# EAGLE design Pir-RElay (EAGLE 9.4.2)
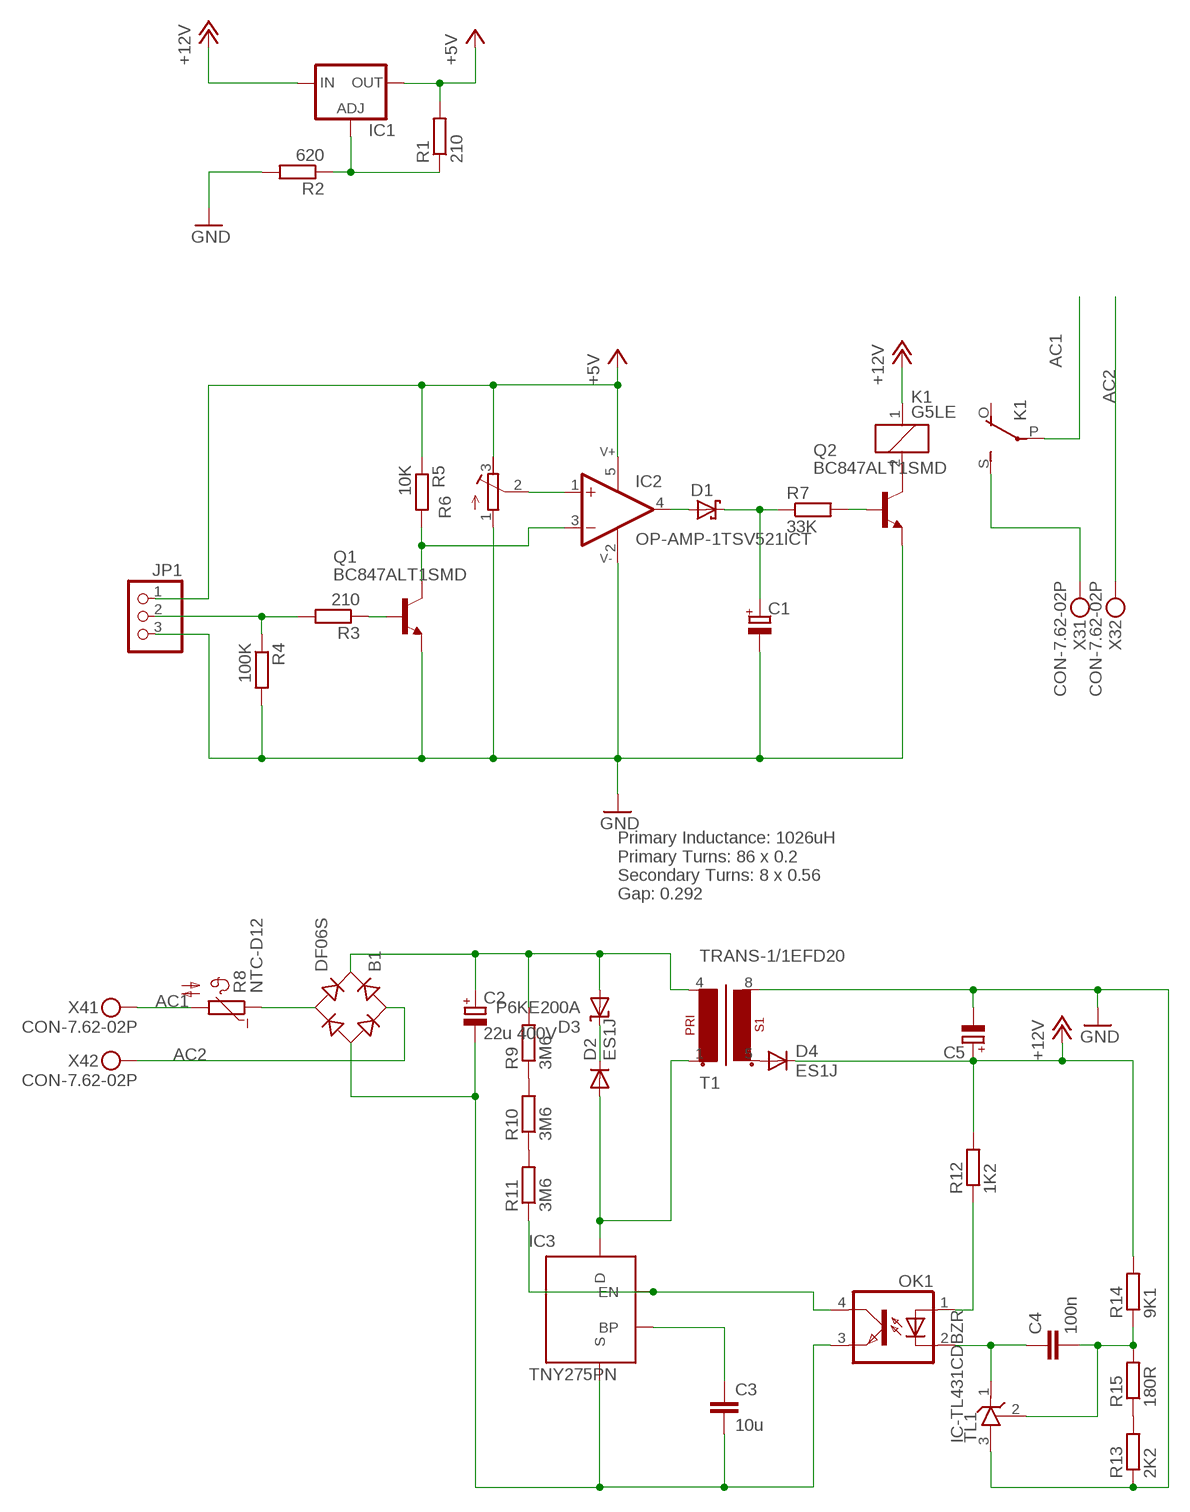
[diagram p0: schematic, sheet 1]

## Parts
B1  DF06S  [DFS]
C1  CAP-POL_E2.5-7  [E2,5-7]
C2  22u 400V  CPOL-EUE5-13  [E5-13]
C3  10u  CAP_1210  [C1210]
C4  100n  CAP_0805  [C0805]
C5  CPOL-EUE7.5-18  [E7,5-18]
D1  DIODE-SH_SOD523  [SODFL1608X65]
D2  ES1J  DIODE_ES1J  [DO214AC]
D3  P6KE200A  SUPRESSORDO-204AC  [DO15-12]
D4  ES1J  DIODE_ES1J  [DO214AC]
IC1  VREG-ADJLD1117S  [SOT230P700X180-4]
IC2  OP-AMP-1TSV521ICT  [SC70-5L]
IC3  TNY275PN  POWER-TNY275  [DIP-8C]
JP1  PINHD-1X3/90  [1X03/90]
K1  G5LE  [G5LE]
OK1  OPTOTRANSPC817  [DIL04]
Q1  BC847ALT1SMD  [SOT23]
Q2  BC847ALT1SMD  [SOT23]
R1  210  R_R0805  [RESC2012X50]
R2  620  R_R0805  [RESC2012X50]
R3  210  R_R0805  [RESC2012X50]
R4  100K  R_R0805  [RESC2012X50]
R5  10K  R_R0805  [RESC2012X50]
R6  R_POT3296X  [POT-3296X]
R7  33K  R_R0805  [RESC2012X50]
R8  NTC-D12  [NTC-D12]
R9  3M6  R_0805  [R0805]
R10  3M6  R_0805  [R0805]
R11  3M6  R_0805  [R0805]
R12  1K2  R_1206  [R1206]
R13  2K2  R_R0805  [RESC2012X50]
R14  9K1  R_1206  [R1206]
R15  180R  R_1206  [R1206]
T1  TRANS-1/1EFD20  [EFD20_8PIN]
TL1  IC-TL431CDBZR  [SOT23]
X3  CON-7.62-02P  [KF25C-7.62-02P-13]
X4  CON-7.62-02P  [KF25C-7.62-02P-13]

## Nets
+5V: IC1.2(OUT) IC1.4(OUT) IC2.5(V+) JP1.1 R1.2 R5.1 R6.3(E)
+12V: C5.+ D4.C IC1.3(IN) K1.1 R12.2 R14.2
AC1: K1.P(2:P) R8.2 X4.P$1
AC2: B1.AC1 X3.P$2 X4.P$2
GND: C1.- C5.- IC2.2(V-) JP1.3 Q1.2(E) Q2.2(E) R2.2 R4.2 R6.1(A) R13.1 T1.8(S1-2) TL1.3(A)
N$1: IC1.1(ADJ) R1.1 R2.1
N$2: B1.AC2 R8.1
N$3: K1.S(2:S) X3.P$1
N$4: Q2.1(B) R7.2
N$5: JP1.2 R3.2 R4.1
N$6: Q1.1(B) R3.1
N$7: IC2.3(-IN) Q1.3(C) R5.2
N$8: IC2.1(+IN) R6.2(S)
N$9: D1.2(A) IC2.4(OUT)
N$10: C1.+ D1.1(C) R7.1
N$11: K1.2 Q2.3(C)
N$16: B1.+ C2.+ D3.A R9.2 T1.4(P1-2)
N$17: B1.- C2.- C3.2 IC3.5(S) IC3.6(S) IC3.7(S) IC3.8(S) OK1.3(EMIT)
N$18: C3.1 IC3.2(BP)
N$19: D2.A IC3.4(D) T1.1(P1-1)
N$20: D2.C D3.C
N$21: IC3.1(EN) OK1.4(COL) R11.1
N$22: R9.1 R10.2
N$23: R10.1 R11.2
N$24: D4.A T1.5(S1-1)
N$26: OK1.1(A) R12.1
N$27: C4.1 OK1.2(C) TL1.1(C)
N$28: C4.2 R14.1 R15.2 TL1.2(R)
N$30: R13.2 R15.1
Unconnected: K1.O(2:O)

## Notes on the sheet
- Primary Inductance: 1026uH
  Primary Turns: 86 x 0.2
  Secondary Turns: 8 x 0.56
  Gap: 0.292

## Library data of the parts
B1 = rectifier:DF*S: Surface Mount Glass Passivated Bridge Rectifiers Source: Source: Comchip Bridge Rectifiers DF005S-G thru DF10S-G.pdf
C1 = Flamberm:CAP-POL_
C2 C5 = rcl:CPOL-EU: POLARIZED CAPACITOR, European symbol; SPICEPREFIX: C
C3 C4 = Namenlos:CAP_
D1 = Flamberm:DIODE-SH_
D2 D4 = Namenlos:DIODE_
D3 = Namenlos:SUPRESSOR
IC1 = Flamberm:VREG-ADJ: VOLTAGE REGULATOR
IC2 = Flamberm:OP-AMP-1
IC3 = Flamberm:POWER-TNY275
JP1 = pinhead:PINHD-1X3: PIN HEADER
K1 = relay:G5LE: RELAY 1 x switch, 10 A/120 V AC, 8 A/30 V DC, Omron; OC_FARNELL: unknown; OC_NEWARK: unknown
OK1 = Namenlos:OPTOTRANS: SHARP OPTO COUPLER; MPN: PC817X4J000F; OC_FARNELL: 9707727; OC_NEWARK: 97K7059
Q1 Q2 = transistor-npn:BC847*: NPN Transistor
R1-R5 R7 R13 = Flamberm:R_
R6 = Flamberm:R_POT
R8 = Namenlos:NTC-D12
R9-R12 R14 R15 = Namenlos:R_
T1 = Namenlos:TRANS-1/1
TL1 = Namenlos:IC-TL431
X3 X4 = Flamberm:CON-7.62-02P

## Board
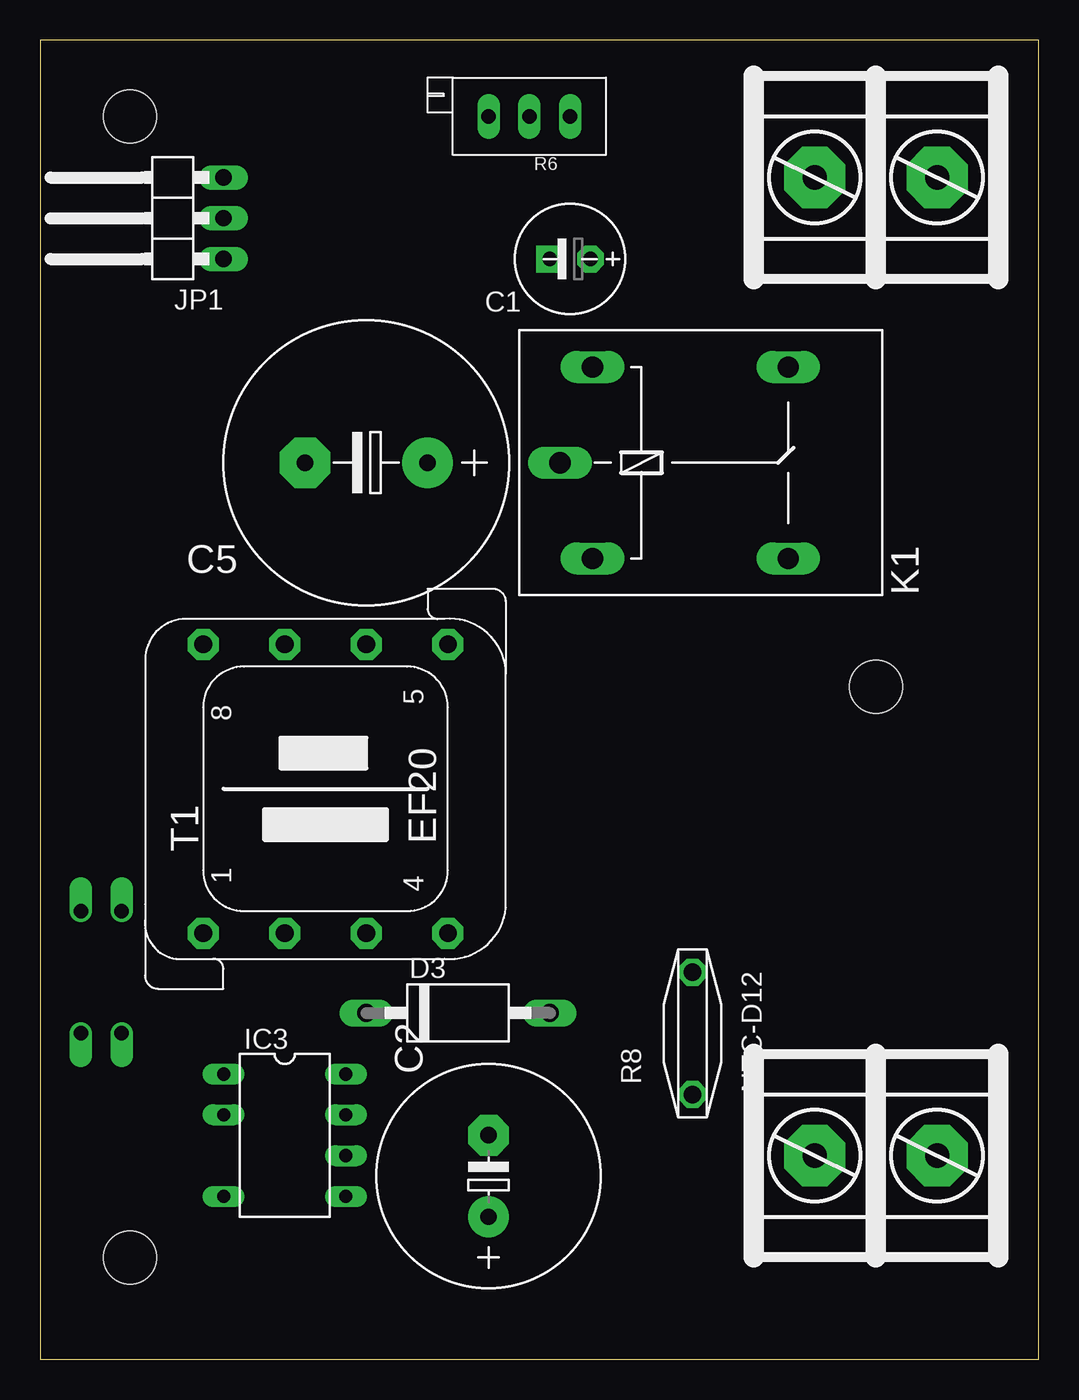
[diagram p1: board, top side]
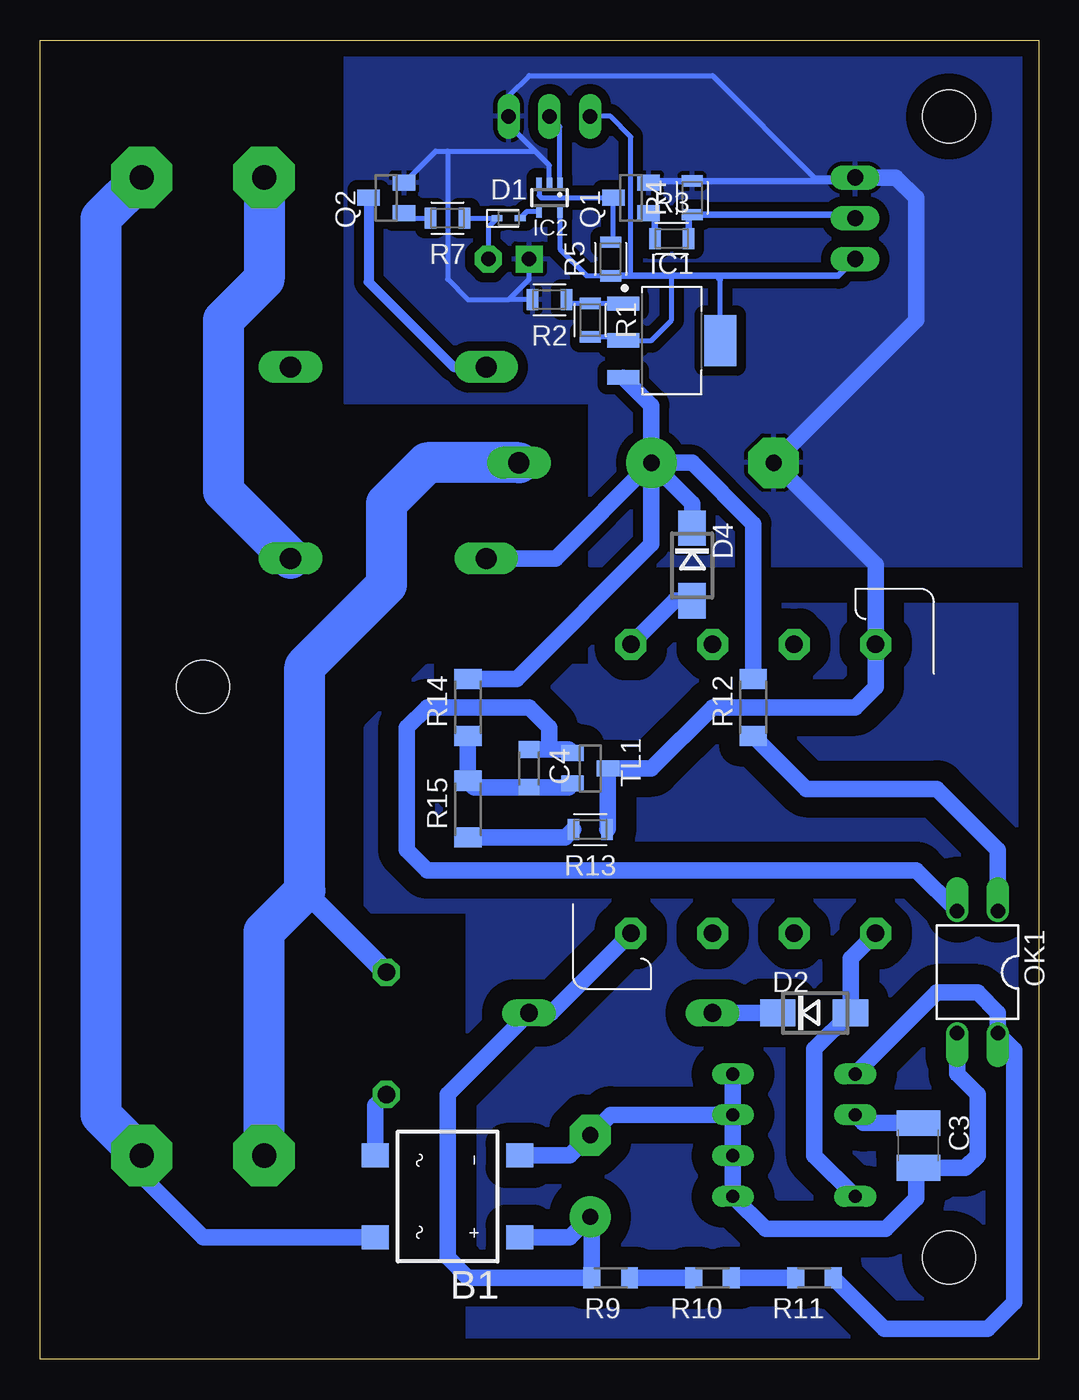
[diagram p2: board, bottom side, seen from below]

Size 62.21 x 82.22 mm. Coordinates in mm from the lower left corner, seen from the top.
Outline: 0,0 62.21,0 62.21,82.22 0,82.22 0,0
Copper layers (1*16): Top 0.035mm / dielectric 1.5mm / Bottom 0.035mm
Design rules "default": minimum track width 6mil, minimum drill 0.35mm, track to track 6mil, track to pad 6mil, pad to pad 6mil, via to via 6mil, smd to smd 6mil, copper to edge 40mil, drill to drill 6mil, minimum pad ring 10mil, minimum via ring 8mil, stop-mask expansion 4mil, vias tented up to drill 0mil, thermal gap 10mil
Holes 3.3 mm at 52.07,41.91 5.59,77.47 5.59,6.35

### Footprints (pad centres in the part's own frame; a part is rotated, then mirrored left to right if it is on the bottom)
DFS = smd 1.5 x 1.7: + -2.55,-4.5; - 2.55,-4.5; AC1 -2.55,4.5; AC2 2.55,4.5
E2,5-7 = drill 0.9 pad 1.676 octagon: + -1.27,0 | drill 0.9 pad 1.676 square: - 1.27,0
E5-13 = drill 1.016 pad 2.54: + -2.54,0 | drill 1.016 pad 2.54 octagon: - 2.54,0
C1210 = smd 1.6 x 2.7: 1 -1.4,0; 2 1.4,0
C0805 = smd 1.05 x 1.3: 1 -1.175,0; 2 1.175,0
E7,5-18 = drill 1.016 pad 3.15: + -3.81,0 | drill 1.016 pad 3.15 octagon: - 3.81,0
SODFL1608X65 = smd 0.66 x 0.398: 1 -0.72,0; 2 0.72,0
DO214AC = smd 2.2 x 1.7: A 2.25,0; C -2.285,0
DO15-12 = drill 1.1 pad 1.676 long: A 5.08,0; C -6.35,0
SOT230P700X180-4 = smd 1.965 x 0.889: 1 -3.023,2.3; 2 -3.023,0; 3 -3.023,-2.3 | smd 1.965 x 3.189: 4 3.023,0
SC70-5L = smd 0.35 x 0.8: 1 -0.65,-0.85; 2 0,-0.85; 3 0.65,-0.85; 4 0.65,0.85; 5 -0.65,0.85
DIP-8C = drill 0.813 long: 1 -3.81,-3.81; 2 -1.27,-3.81; 4 3.81,-3.81; 5 3.81,3.81; 6 1.27,3.81; 7 -1.27,3.81; 8 -3.81,3.81
1X03/90 = drill 1.016 long: 1 -2.54,-3.81; 2 0,-3.81; 3 2.54,-3.81
G5LE = drill 1.321 long: 1 -7.493,-5.969; 2 -7.493,5.969; O 4.699,5.969; P -9.525,0; S 4.699,-5.969
DIL04 = drill 0.9 pad 1.27 offset: 1 -1.27,-3.81; 2 1.27,-3.81; 3 1.27,3.81; 4 -1.27,3.81
SOT23 = smd 1 x 1.4: 1 -0.95,-1.1; 2 0.95,-1.1; 3 0,1.1
RESC2012X50 = smd 0.712 x 1.312: 1 -1.05,0; 2 1.05,0
POT-3296X = drill 0.9 long: 1 0,-2.54; 2 0,0; 3 0,2.54
NTC-D12 = drill 1.1 pad 1.676 octagon: 1 -3.81,0; 2 3.81,0
R0805 = smd 1.05 x 1.3: 1 -1.175,0; 2 1.175,0
R1206 = smd 1.25 x 1.7: 1 -1.775,0; 2 1.775,0
EFD20_8PIN = drill 1.1 pad 1.93 octagon: 1 -9,7.62; 2 -9,2.54; 3 -9,-2.54; 4 -9,-7.62; 5 9,-7.62; 6 9,-2.54; 7 9,2.54; 8 9,7.62
KF25C-7.62-02P-13 = drill 1.5 pad 3.81 octagon: P$1 -3.81,0; P$2 3.81,0

### Placement (x,y rotation side)
B1  36.83,10.16 90 bottom
C1  33.02,68.58 180 top
C2  27.94,11.43 90 top
C3  7.49,13.34 270 bottom
C4  31.75,36.83 270 bottom
C5  20.32,55.88 180 top
D1  33.02,71.12 0 bottom
D2  13.97,21.59 0 bottom
D3  26.67,21.59 0 top
D4  21.59,49.53 270 bottom
IC1  22.86,63.5 0 bottom
IC2  30.48,72.39 180 bottom
IC3  15.24,13.97 270 top
JP1  7.62,71.12 90 top
K1  41.91,55.88 0 top
OK1  3.81,24.13 180 bottom
Q1  25.4,72.39 90 bottom
Q2  40.64,72.39 90 bottom
R1  27.94,64.77 270 bottom
R2  30.48,66.04 180 bottom
R3  22.86,69.85 0 bottom
R4  21.59,72.39 90 bottom
R5  26.67,68.58 90 bottom
R6  30.48,77.47 90 top
R7  36.83,71.12 180 bottom
R8  40.64,20.32 90 top
R9  26.67,5.08 180 bottom
R10  20.32,5.08 180 bottom
R11  13.97,5.08 180 bottom
R12  17.78,40.64 90 bottom
R13  27.94,33.02 180 bottom
R14  35.56,40.64 90 bottom
R15  35.56,34.29 90 bottom
T1  17.78,35.56 90 top
TL1  27.94,36.83 270 bottom
X3  52.07,73.66 0 top
X4  52.07,12.7 0 top

### Tracks (layer width: path | path; a pad name or v marks a point on that pad's centre or on a via)
+5V
  Bottom 0.305: IC2.5 29.83,69.2 28.16,67.53 R5.1 | 25.4,67.53 25.4,76.2 26.67,77.47 R6.3 | IC1.4 19.84,67.27 20.1,67.53 | R1.2 26.1,63.72 IC1.2 24.13,63.5 22.86,64.77 22.86,67.53
  Bottom 0.406: JP1.1 12.48,67.53 20.1,67.53 22.86,67.53 25.4,67.53 R5.1
+12V
  Bottom 0.61: IC1.3 25.4,60.72
  Bottom 1.016: D4.C 21.59,53.34 C5.+ | K1.1 30.1,49.91 C5.+ | C5.+ 24.13,59.45 IC1.3 | R14.2 32.52,42.41 24.13,50.8 C5.+ | R12.2 17.78,52.07 21.59,55.88 C5.+
AC1
  Bottom 1.27: R8.2 45.72,29.21
  Bottom 2.54: K1.P 38.1,55.88 40.64,53.34 40.64,48.26 45.72,43.18 45.72,29.21 48.26,26.67 X4.P$1
AC2
  Bottom 1.016: B1.AC1 52.06,7.61 55.88,11.43 X4.P$2
  Bottom 2.54: X3.P$2 58.42,71.12 58.42,15.24 X4.P$2
GND
  Bottom 0.305: IC2.2 30.48,74.42 31.37,75.31 | 31.37,75.31 33.02,76.96 R6.1 33.02,78.74 31.75,80.01 20.32,80.01 13.97,73.66 JP1.3 | Q2.2 37.57,75.31 36.83,75.31 | 36.83,75.31 31.37,75.31 | 36.83,75.31 36.83,67.31 35.56,66.04 33.02,66.04 | 33.02,66.04 31.75,67.31 C1.- | R2.2 33.02,66.04
  Bottom 0.406: JP1.3 11.65,73.44 R4.2 24.2,73.44 Q1.2
  Bottom 1.016: JP1.3 8.89,73.66 7.62,72.39 7.62,64.77 C5.- 10.16,49.53 T1.8 10.16,41.91 11.43,40.64 20.32,40.64 24.13,36.83 TL1.3 26.84,33.07 R13.1
  pour Bottom (isolate 0.61): 0,82.55 43.18,82.55 43.18,59.69 27.94,59.69 27.94,49.53 0,49.53
N$1
  Bottom 0.305: IC1.1 25.9,65.82 R1.1 29.21,65.82 R2.1
N$2
  Bottom 1.016: R8.1 41.33,15.82 B1.AC2
N$3
  Bottom 2.54: X3.P$1 48.26,67.31 50.8,64.77 50.8,54.1 K1.S
N$4
  Bottom 0.305: Q2.1 39.22,71.12 R7.2
N$5
  Bottom 0.406: JP1.2 11.65,71.34 R4.1 21.81,71.12 R3.2
N$6
  Bottom 0.406: R3.1 23.91,71.05 Q1.1
N$7
  Bottom 0.305: IC2.3 31.13,72.53 30.99,72.39 Q1.3 26.5,69.8 R5.2
N$8
  Bottom 0.305: IC2.1 29.83,76.82 R6.2
N$9
  Bottom 0.305: IC2.4 31.88,71.54 D1.2
N$10
  Bottom 0.305: C1.+ 34.29,70.57 D1.1 R7.1
N$11
  Bottom 0.61: Q2.3 41.74,67.14 36.45,61.85 K1.2
N$12
  pour Bottom (isolate 1.27): 0,46.99 27.94,46.99 27.94,43.18 38.1,43.18 41.91,39.37 41.91,27.94 35.56,27.94 35.56,0 0,0
N$16
  Bottom 1.016: B1.+ 29.22,7.61 C2.+ 27.84,8.79 R9.2 35.56,5.08 36.83,6.35 36.83,16.51 D3.A 30.37,21.59 T1.4
N$17
  Bottom 1.016: B1.- 29.2,12.71 C2.- 26.67,15.24 IC3.7 | 7.62,12.06 C3.2 4.58,11.94 3.81,12.7 3.81,16.51 5.08,17.78 OK1.3 | IC3.7 IC3.6 IC3.5 17.02,8.12 9.53,8.12 7.62,10.03 7.62,12.06 | IC3.8 IC3.7 | 7.62,12.06
N$18
  Bottom 1.016: 11.56,15.37 IC3.2 10.93,14.73 C3.1
N$19
  Bottom 1.016: T1.1 11.72,25 D2.A 13.97,19.34 13.97,12.7 IC3.4
N$20
  Bottom 1.016: D2.C D3.C
N$21
  Bottom 1.016: IC3.1 6.35,22.86 3.81,22.86 2.54,21.59 OK1.4 1.52,19.3 1.52,3.56 3.17,1.91 9.62,1.91 R11.1
N$22
  Bottom 1.016: R9.1 R10.2
N$23
  Bottom 1.016: R10.1 R11.2
N$24
  Bottom 1.016: T1.5 22.68,47.28 D4.A
N$26
  Bottom 1.016: R12.1 14.47,35.56 6.35,35.56 2.54,31.75 OK1.1
N$27
  Bottom 1.016: TL1.1 29.27,38.01 30.48,38.01 | 30.48,38.01 C4.1 | OK1.2 7.62,30.48 38.1,30.48 39.37,31.75 39.37,39.37 38.1,40.64 31.75,40.64 30.48,39.37 30.48,38.01
N$28
  Bottom 1.016: R14.1 R15.2 35.15,35.66 C4.2 29.27,35.66 TL1.2
N$30
  Bottom 1.016: R15.1 29.5,32.52 R13.2